# EAGLE board lamloei_unofox_sfm10r4 (EAGLE 7.7.0), part 1 of 2
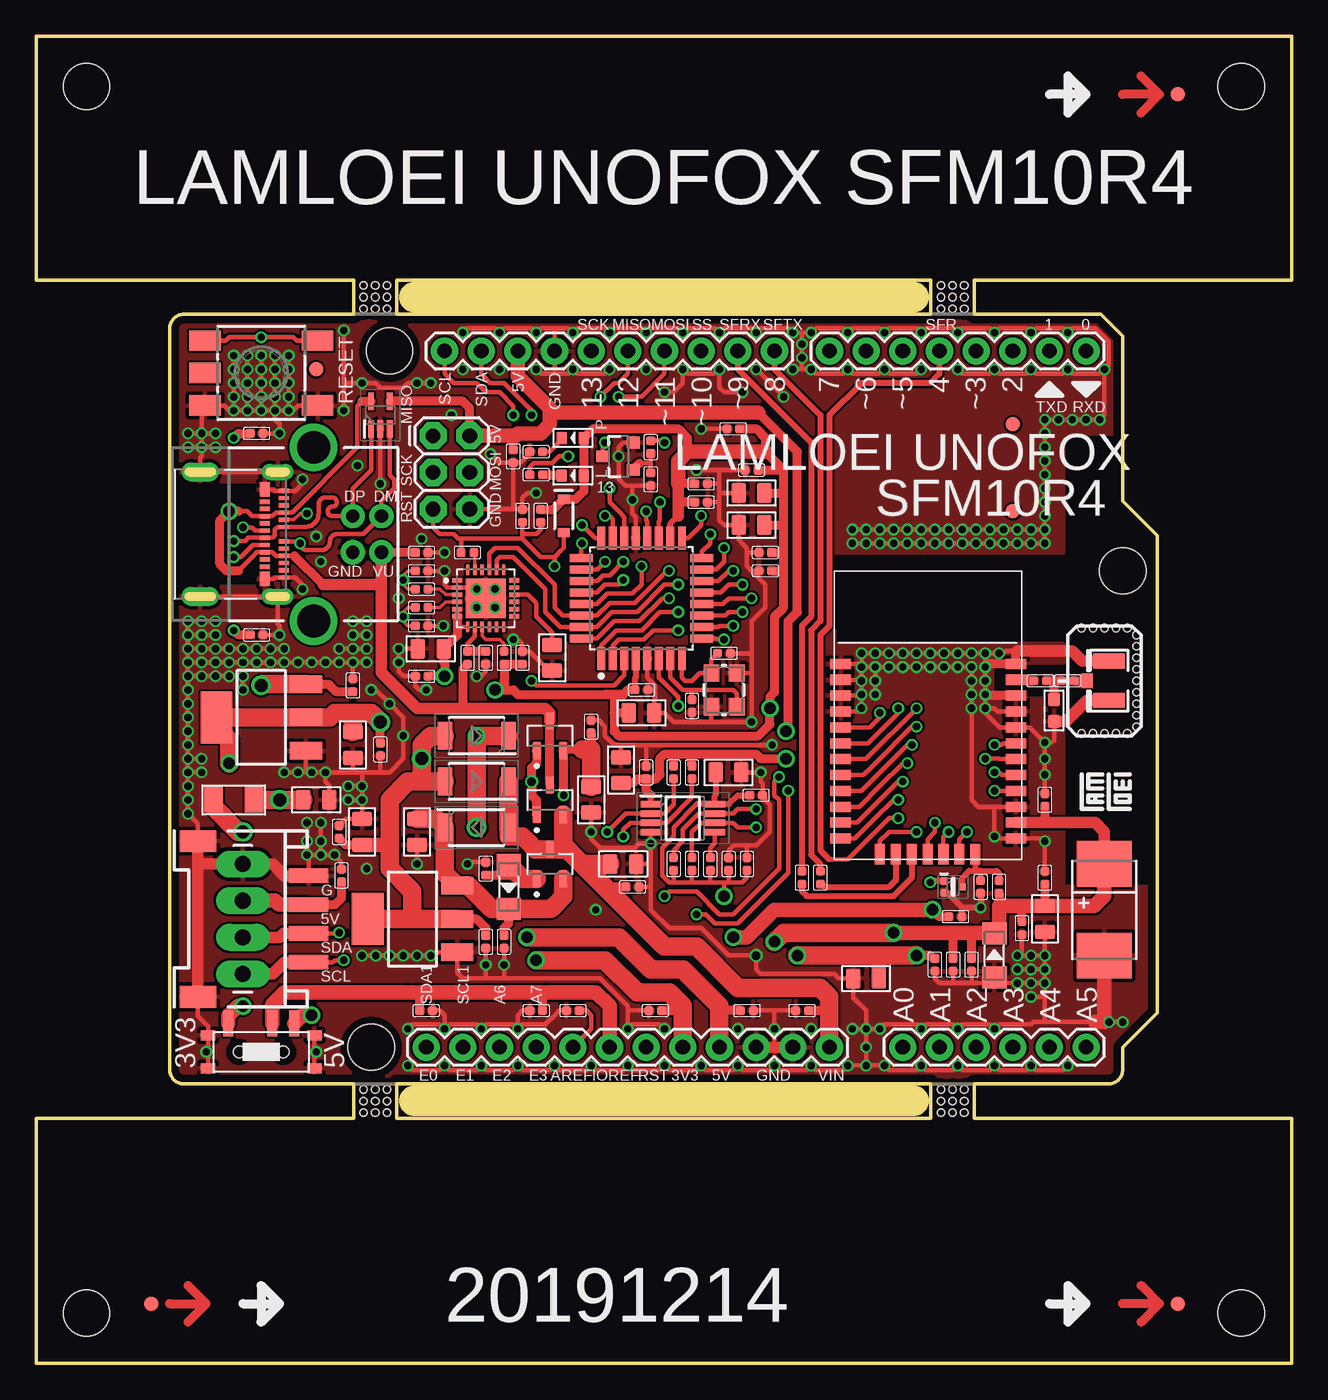
[diagram p2: board, top side]
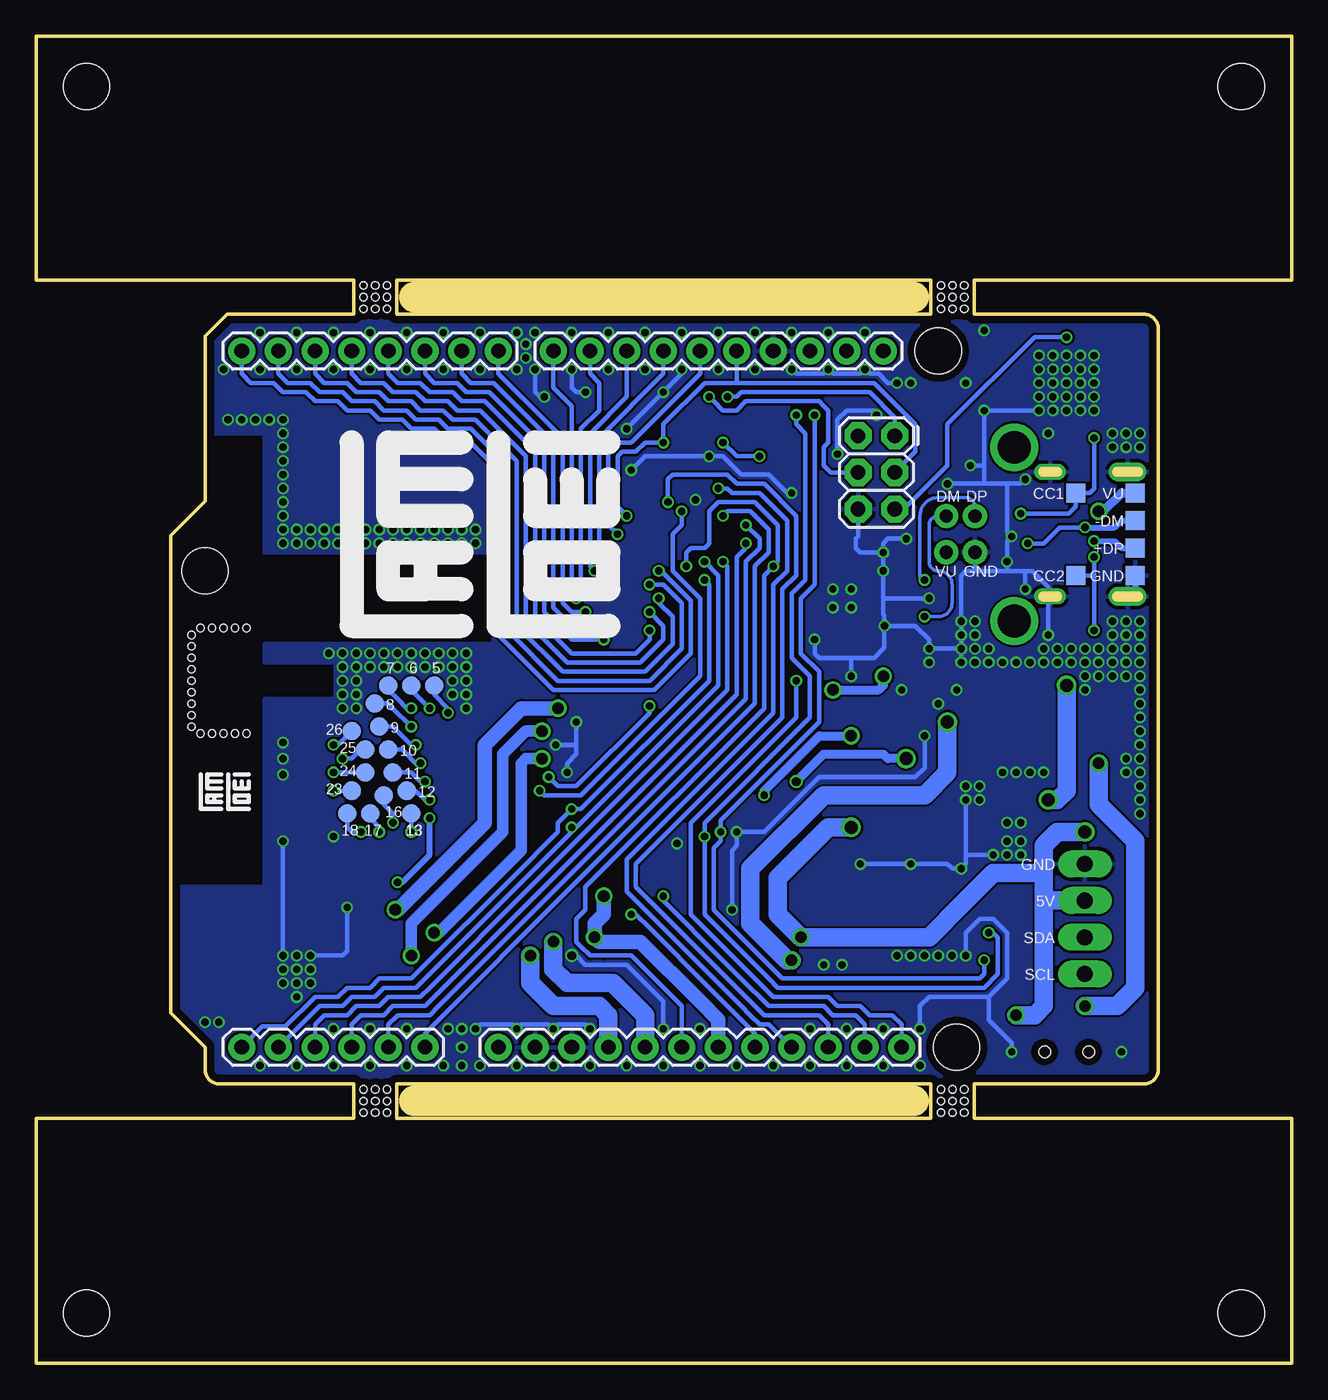
[diagram p3: board, bottom side, seen from below]

Size 87 x 92 mm. Coordinates in mm from the lower left corner, seen from the top.
Outline: 73.77,72.72 75.29,71.19 75.29,59.76 77.67,57.38 77.67,24.3 75.29,21.91 75.29,20.38 arc-90 74.29,19.38 65,19.38 65,17 87,17 87,0 0,0 0,17 22,17 22,19.38 10.25,19.38 arc-90 9.25,20.38
Outline: 9.25,20.39 9.25,71.72 arc-90 10.25,72.72 22,72.72 22,75.09 0,75.09 0,92 87,92 87,75.09 65,75.09 65,72.72 73.75,72.72
Outline: 62,19.38 25,19.38 25,17 62,17 62,19.38
Outline: 62,72.72 62,75.09 25,75.09 25,72.72 62,72.72
Copper layers (1*16): Top 0.035mm / dielectric 1.6mm / Bottom 0.035mm
Design rules "Elecrow_2-layer_PCB_eagle_rule-40": minimum track width 6mil, minimum drill 12mil, track to track 6mil, track to pad 6mil, pad to pad 6mil, via to via 8mil, smd to smd 0mil, copper to edge 20mil, drill to drill 10mil, minimum pad ring 6mil, minimum via ring 6mil, stop-mask expansion 0mil, vias tented up to drill 40mil, thermal gap 10mil
Net classes: 0 default: width 0.254 mm, clearance 0.152 mm; 1 power: width 0.61 mm, drill 0.61 mm, clearance 0.152 mm; 2 gnd: width 0.305 mm, drill 0.483 mm, clearance 0.152 mm; 3 usbvcc: width 0.508 mm, drill 0.61 mm, clearance 0.152 mm; 4 aref: width 0.406 mm, drill 0.61 mm, clearance 0.152 mm
Holes 3.2 mm at 75.29,54.94 24.49,70.17 23.22,21.91 3.5,88.5 3.5,3.5 83.5,88.5 83.5,3.5
Holes 0.5 mm at 23.5,19 22.69,19 24.31,19 63.5,19 64.31,19 62.69,19 22.69,18.19 22.69,17.38 23.5,17.38 23.5,18.19 24.31,18.19 24.31,17.38 63.5,18.19 62.69,18.19 62.69,17.38 63.5,17.38 64.31,17.38 64.31,18.19 63.5,73.09 23.5,73.09 24.31,73.09 22.69,73.09 23.5,73.91 24.31,73.91 22.69,73.91 22.69,74.72 23.5,74.72 24.31,74.72 64.31,73.09 62.69,73.09 63.5,73.91 64.31,73.91 62.69,73.91 62.69,74.72 63.5,74.72 64.31,74.72 72.43,43.66 73.23,43.66 74.02,43.66 74.81,43.66 75.61,43.66 76.24,44.14 76.24,50.49 76.24,44.93 76.24,45.73 76.24,46.52 76.24,47.31 76.24,48.11 76.24,48.9 76.24,49.7 72.43,50.97 73.23,50.97 74.02,50.97 74.81,50.97 75.61,50.97
Milling: 2 lines

## Footprints (pad centres in the part's own frame; a part is rotated, then mirrored left to right if it is on the bottom)
U.FL = smd 2.2 x 1.05: 1 0,1.375; 2 0,-1.375 | smd 0.8 x 1: 3 1.525,0
C0402 = smd 0.635 x 0.635: 1 0,0.445; 2 0,-0.445
C0805 = smd 1.397 x 1.016: 1 0,0.889; 2 0,-0.889
TE-D-7343 = smd 3.175 x 3.81: + 3.175,0; - -3.175,0
SODFL4725X110N = smd 1 x 1.93: 1 -2.2,0; 2 2.2,0
SOD-323 = smd 0.63 x 0.83: A 1.15,0; C -1.15,0
LL-34 = smd 1.524 x 1.676: A -1.524,0; C 1.524,0
F1206 = smd 1.27 x 1.778: 1 -1.397,0; 2 1.397,0
1X08 = drill 1.016 pad 1.88: 1 0,0; 2 2.54,0; 3 5.08,0; 4 7.62,0; 5 10.16,0; 6 12.7,0; 7 15.24,0; 8 17.78,0
1X10 = drill 1.016 pad 1.88: 1 0,0; 2 2.54,0; 3 5.08,0; 4 7.62,0; 5 10.16,0; 6 12.7,0; 7 15.24,0; 8 17.78,0; 9 20.32,0; 10 22.86,0
1X06 = drill 1.016 pad 1.88: 1 0,0; 2 2.54,0; 3 5.08,0; 4 7.62,0; 5 10.16,0; 6 12.7,0
1X12 = drill 1.016 pad 1.88: 1 0,0; 2 2.54,0; 3 5.08,0; 4 7.62,0; 5 10.16,0; 6 12.7,0; 7 15.24,0; 8 17.78,0; 9 20.32,0; 10 22.86,0; 11 25.4,0; 12 27.94,0
2X3 = drill 1.016 pad 1.88 octagon: 1 0,0; 2 0,2.54; 3 2.54,0; 4 2.54,2.54; 5 5.08,0; 6 5.08,2.54
HW4-SMD-2.0-90D = smd 1.01 x 2.74: 1 -3,-0.1; 2 -1,-0.1; 3 1,-0.1; 4 3,-0.1 | smd 1.5 x 2.54: SS1 -5.4,7.559; SS2 5.4,7.559
1X04_LONGPADS = drill 1.118 pad 1.88 long: 1 0,0; 2 2.54,0; 3 5.08,0; 4 7.62,0
SKHM = smd 2.2 x 1.4: 1 -3.9,2.25; 2 3.9,2.25; 3 -3.9,-2.25; 4 3.9,-2.25; 5 3.9,0
SW7-SMD-L6.7X2.7X3.2MM = smd 1.8 x 0.7: A 1.978,2.286; B 1.978,-2.286; COM 1.978,-0.762 | smd 0.7 x 1.016: SS1 -1.15,-3.683; SS2 1.15,-3.683; SS3 1.15,3.683; SS4 -1.15,3.683 | hole 0.813: 0,-1.524; 0,1.524
L0603 = smd 0.889 x 0.889: 1 -0.762,0; 2 0.762,0
LED-0603 = smd 0.762 x 0.889: + -0.762,0; - 0.762,0
SOT23-3 = smd 0.8 x 0.9: 1 -0.95,-1; 2 0.95,-1; 3 0,1.1
SOT91P240X110-3N_DMG2305UX-7 = smd 1.18 x 0.61: 1 -1.025,0.915; 2 -1.025,-0.915; 3 1.025,0
SOTFL40P120X55-3N = smd 0.475 x 0.5: 1 -0.638,0.4; 2 -0.638,-0.4; 3 0.638,0
R0402 = smd 0.635 x 0.635: 1 0,0.445; 2 0,-0.445
TP13SQ = smd 1.3 x 1.3: TP 0,0
B1,27 = smd 1.27 x 1.27: TP 0,0
QFP80P900X900X120-32N = smd 1.6 x 0.55: 1 -4.18,2.8; 2 -4.18,2; 3 -4.18,1.2; 4 -4.18,0.4; 5 -4.18,-0.4; 6 -4.18,-1.2; 7 -4.18,-2; 8 -4.18,-2.8; 17 4.18,-2.8; 18 4.18,-2; 19 4.18,-1.2; 20 4.18,-0.4; 21 4.18,0.4; 22 4.18,1.2; 23 4.18,2; 24 4.18,2.8 | smd 0.55 x 1.6: 9 -2.8,-4.18; 10 -2,-4.18; 11 -1.2,-4.18; 12 -0.4,-4.18; 13 0.4,-4.18; 14 1.2,-4.18; 15 2,-4.18; 16 2.8,-4.18; 25 2.8,4.18; 26 2,4.18; 27 1.2,4.18; 28 0.4,4.18; 29 -0.4,4.18; 30 -1.2,4.18; 31 -2,4.18; 32 -2.8,4.18
CP2104-F03-GMR = smd 0.7 x 0.25: 1 -1.975,1.25; 2 -1.975,0.75; 3 -1.975,0.25; 4 -1.975,-0.25; 5 -1.975,-0.75; 6 -1.975,-1.25; 13 1.975,-1.25; 14 1.975,-0.75; 15 1.975,-0.25; 16 1.975,0.25; 17 1.975,0.75; 18 1.975,1.25 | smd 0.25 x 0.7: 7 -1.25,-1.975; 8 -0.75,-1.975; 9 -0.25,-1.975; 10 0.25,-1.975; 11 0.75,-1.975; 12 1.25,-1.975; 19 1.25,1.975; 20 0.75,1.975; 21 0.25,1.975; 22 -0.25,1.975; 23 -0.75,1.975; 24 -1.25,1.975 | smd 2.75 x 2.75: 25 0,0
SOT223 = smd 1.219 x 2.235: 1 -2.311,-3.099; 2 0,-3.099; 3 2.311,-3.099 | smd 3.6 x 2.2: 4 0,3.099
SOT65P210X110-5N = smd 1.2 x 0.4: 1 -0.95,0.65; 2 -0.95,0; 3 -0.95,-0.65; 4 0.95,-0.65; 5 0.95,0.65
SOP65P490X110-8N = smd 1.425 x 0.45: 1 -2.212,0.975; 2 -2.212,0.325; 3 -2.212,-0.325; 4 -2.212,-0.975; 5 2.212,-0.975; 6 2.212,-0.325; 7 2.212,0.325; 8 2.212,0.975
WSSFM10R = smd 1.4 x 0.7: 1 0.45,13.55; 2 0.45,12.45; 3 0.45,11.35; 4 0.45,10.25; 5 0.45,9.15; 6 0.45,8.05; 7 0.45,6.95; 8 0.45,5.85; 9 0.45,4.75; 10 0.45,3.65; 11 0.45,2.55; 12 0.45,1.45; 20 12.6,1.45; 21 12.6,2.55; 22 12.6,3.65; 23 12.6,4.75; 24 12.6,5.85; 25 12.6,6.95; 26 12.6,8.05; 27 12.6,9.15; 28 12.6,10.25; 29 12.6,11.35; 30 12.6,12.45; 31 12.6,13.55 | smd 0.7 x 1.4: 13 3.18,0.36; 14 4.28,0.36; 15 5.38,0.36; 16 6.48,0.36; 17 7.58,0.36; 18 8.68,0.36; 19 9.78,0.36
105450-0101 = smd 0.3 x 0.7: A1 -3,3.77; A2 -2.5,3.77; A3 -2,3.77; A4 -1.5,3.77; A5 -1,3.77; A6 -0.5,3.77; A7 0.5,3.77; A8 1,3.77; A9 1.5,3.77; A10 2,3.77; A11 2.5,3.77; A12 3,3.77; B2 2.25,2.47; B3 1.75,2.47; B4 1.25,2.47; B5 0.75,2.47; B6 0.25,2.47; B7 -0.25,2.47; B8 -0.75,2.47; B9 -1.25,2.47; B10 -1.75,2.47; B11 -2.25,2.47 | smd 1 x 0.7: B1 3.1,2.47; B12 -3.1,2.47 | drill 0.6 pad 1.1 long: S1 -4.32,3.36; S2 4.32,3.36 | drill 0.6 pad 1.3 long: S3 -4.32,-2; S4 4.32,-2
USB-B-PTH = drill 0.914 pad 1.676: D+ 0,1.25; D- 1.981,1.25; GND 0,-1.25; VBUS 1.981,-1.25 | drill 2.286: S1 -2.718,-6.02; S2 -2.718,6.02
CRYSTAL-SMD-3.2X2.5MM = smd 1.2 x 1.1: 1 -1.175,-0.875; 2 1.175,-0.875; 3 1.175,0.875; 4 -1.175,0.875
FIDUCIAL-1X2 = smd 1 x 1: 1 0,0

## Placement (x,y rotation side)
ANT1  [U.FL]  74.34,47.31 180 top
C1  100nf  [C0402]  26.71,56.2 270 top
C2  NC  [C0402]  26.71,54.94 270 top
C3  NC  [C0402]  26.71,51.12 270 top
C4  4.7uf  [C0805]  27.35,49.54 90 top
C5  100nf  [C0402]  26.71,47.63 90 top
C6  100nf  [C0402]  33.7,48.9 0 top
C7  100nf  [C0402]  29.89,56.2 90 top
C8  4.7uf  [C0805]  35.76,48.9 180 top
C9  100nf  [C0402]  33.06,62.87 180 top
C10  100nf  [C0402]  33.7,58.74 0 top
C11  100nf  [C0402]  48.3,64.78 90 top
C12  100nf  [C0402]  46.08,60.97 270 top
C13  100nf  [C0402]  46.08,59.7 270 top
C14  100nf  [C0402]  49.57,61.92 90 top
C15  4.7uf  [C0805]  49.57,60.33 90 top
C16  4.7uf  [C0805]  49.57,58.11 90 top
C17  100nf  [C0402]  50.52,56.2 90 top
C18  100nf  [C0402]  50.52,54.94 90 top
C19  10pf  [C0402]  47.67,49.22 270 top
C20  10pf  [C0402]  45.45,45.57 180 top
C21  100nf  [C0402]  41.95,46.68 270 top
C22  4.7uf  [C0805]  41.95,45.09 270 top
C23  100nf  [C0402]  21.95,47 0 top
C24  4.7uf  [C0805]  21.95,42.87 180 top
C25  100nf  [C0402]  23.86,42.55 180 top
C26  4.7uf  [C0805]  19.41,39.06 270 top
C27  100nf  [C0402]  21,36.84 0 top
C28  4.7uf  [C0805]  22.59,36.84 0 top
C29  4.7uf  [C0805]  26.39,36.84 180 top
C30  100nf  [C0402]  21.16,33.82 0 top
C31  100nf  [C0402]  38.46,44.14 0 top
C32  4.7uf  [C0805]  38.46,39.06 180 top
C33  100nf  [C0402]  31.16,29.22 180 top
C34  100nf  [C0402]  32.43,29.22 180 top
C35  4.7uf  [C0805]  40.68,34.62 270 top
C36  100nf  [C0402]  41.32,33.03 270 top
C37  4.7uf  [C0805]  40.52,41.12 0 top
C38  100nf  [C0402]  42.27,40.97 0 top
C39  4.7uf  [C0805]  47.98,40.97 270 top
C40  100nf  [C0402]  49.89,39.38 270 top
C41  100nf  [C0402]  47.98,34.62 0 top
C42  100nf  [C0402]  49.26,34.62 0 top
C43  100nf  [C0402]  27.03,24.45 270 top
C44  100nf  [C0402]  34.65,24.45 90 top
C45  100nf  [C0402]  37.19,24.45 90 top
C46  100nf  [C0402]  42.91,24.45 90 top
C47  100nf  [C0402]  49.26,24.45 270 top
C48  100nf  [C0402]  53.06,24.45 90 top
C49  4.7uf  [C0805]  57.51,26.68 90 top
C50  100nf  [C0402]  62.27,27.63 180 top
C51  100nf  [C0402]  63.54,27.63 180 top
C52  100nf  [C0402]  64.81,27.63 180 top
C53  100nf  [C0402]  63.7,30.96 270 top
C54  100nf  [C0402]  65.45,33.03 180 top
C55  100nf  [C0402]  68.31,30.17 180 top
C56  4.7uf  [C0805]  69.89,30.8 180 top
C57  [TE-D-7343]  74.02,31.44 90 top
C58  100nf  [C0402]  69.89,33.66 0 top
C59  100nf  [C0402]  69.89,39.06 0 top
C60  100pf  [C0402]  69.58,47.31 270 top
D1  PMEG4050EP,115  [SODFL4725X110N]  30.52,43.5 180 top
D2  PMEG4050EP,115  [SODFL4725X110N]  30.52,40.33 180 top
D3  PMEG4050EP,115  [SODFL4725X110N]  30.52,37.16 0 top
D4  1N4148  [SOD-323]  36.55,58.74 270 top
D5  [LL-34]  32.75,33.03 270 top
D6  [LL-34]  66.4,28.27 90 top
F1  SMD1206R500SF  [F1206]  13.7,39.06 0 top
J1  [1X08]  72.75,70.17 180 top
J2  [1X10]  51.16,70.17 180 top
J3  [1X06]  72.75,21.91 180 top
J4  [1X12]  54.97,21.91 180 top
J5  FEMALE 2x3  [2X3]  27.51,64.3 270 top
J6  4P-SMD-2.0-90D  [HW4-SMD-2.0-90D]  18.77,30.8 90 top
J7  [1X04_LONGPADS]  14.33,34.62 270 top
K1  SKHM  [SKHM]  15.6,68.65 180 top
K2  MK-12C02  [SW7-SMD-L6.7X2.7X3.2MM]  15.6,21.6 90 top
L1  47nH  [L0603]  70.53,45.25 90 top
LED1  BLUE-0603  [LED-0603]  37.19,64.14 180 top
LED2  YELLOW-0603  [LED-0603]  37.19,61.54 180 top
Q1  220mA/50V/3.5Ω  [SOT23-3]  40.36,62.87 90 top
Q2  DMG2305UX-7  [SOT91P240X110-3N_DMG2305UX-7]  35.6,43.5 90 top
Q3  DMG2305UX-7  [SOT91P240X110-3N_DMG2305UX-7]  35.6,39.06 90 top
Q4  DMG2305UX-7  [SOT91P240X110-3N_DMG2305UX-7]  35.6,34.62 90 top
Q5  DTC044TMT2L  [SOTFL40P120X55-3N]  63.54,33.03 0 top
R1  5.1K  [R0402]  15.28,64.46 270 top
R2  5.1K  [R0402]  15.28,50.49 270 top
R3  0R  [R0402]  26.71,53.66 90 top
R4  0R  [R0402]  26.71,52.4 90 top
R5  24K  [R0402]  29.89,48.9 0 top
R6  47K  [R0402]  31.16,48.9 0 top
R7  12K  [R0402]  32.43,48.9 180 top
R8  2.2K  [R0402]  34.65,63.19 90 top
R9  2.2K  [R0402]  34.65,61.6 90 top
R10  2.2K  [R0402]  42.59,63.51 180 top
R11  100K  [R0402]  42.59,61.28 180 top
R12  12K  [R0402]  34.97,58.74 180 top
R13  100K  [R0402]  31.16,34.3 0 top
R14  100K  [R0402]  44.17,40.97 180 top
R15  100K  [R0402]  45.45,40.97 180 top
R16  100K  [R0402]  44.17,34.62 0 top
R17  100K  [R0402]  45.45,34.62 0 top
R18  100K  [R0402]  46.72,34.62 180 top
R19  0  [R0402]  53.06,33.66 180 top
R20  0  [R0402]  54.34,33.66 180 top
R21  12K  [R0402]  66.72,33.03 0 top
R22  0  [R0402]  71.48,47.31 270 top
TP1  TPSQTP13SQ  [TP13SQ]  10.84,60.33 0 bottom
TP2  TPSQTP13SQ  [TP13SQ]  10.84,58.43 0 bottom
TP3  TPSQTP13SQ  [TP13SQ]  10.84,56.52 0 bottom
TP4  TPSQTP13SQ  [TP13SQ]  10.84,54.62 0 bottom
TP5  TPSQTP13SQ  [TP13SQ]  14.96,60.33 0 bottom
TP6  TPSQTP13SQ  [TP13SQ]  14.96,54.62 0 bottom
TP7  PTR1B1,27  [B1,27]  59.41,47 0 bottom
TP8  PTR1B1,27  [B1,27]  61,47 0 bottom
TP9  PTR1B1,27  [B1,27]  62.59,47 0 bottom
TP10  PTR1B1,27  [B1,27]  63.54,45.73 0 bottom
TP11  PTR1B1,27  [B1,27]  63.23,44.14 0 bottom
TP12  PTR1B1,27  [B1,27]  62.59,42.55 0 bottom
TP13  PTR1B1,27  [B1,27]  62.27,40.97 0 bottom
TP14  PTR1B1,27  [B1,27]  61.32,39.7 0 bottom
TP15  PTR1B1,27  [B1,27]  61,38.11 0 bottom
TP16  PTR1B1,27  [B1,27]  62.91,39.38 0 bottom
TP17  PTR1B1,27  [B1,27]  63.86,38.11 0 bottom
TP18  PTR1B1,27  [B1,27]  65.45,38.11 0 bottom
TP19  PTR1B1,27  [B1,27]  65.13,39.7 0 bottom
TP20  PTR1B1,27  [B1,27]  64.18,40.97 0 bottom
TP21  PTR1B1,27  [B1,27]  64.18,42.55 0 bottom
TP22  PTR1B1,27  [B1,27]  65.13,43.82 0 bottom
U1  ATMEGA328PB-AU  [QFP80P900X900X120-32N]  41.95,53.03 90 top
U2  CP2104-F03-GMR  [CP2104-F03-GMR]  31.16,53.03 0 top
U3  [SOT223]  15.6,44.77 90 top
U4  [SOT223]  26.08,30.8 90 top
U5  ESDA6V1W5  [SOT65P210X110-5N]  23.86,65.73 90 top
U6  PCA9517ADP,118  [SOP65P490X110-8N]  44.81,37.79 0 top
U7  WSSFM10RWSSFM10R2R4  [WSSFM10R]  55.29,34.93 0 top
USB1  105450-0101  [105450-0101]  13.38,57.48 270 top
USB2  USB-B  [USB-B-PTH]  21.95,57.48 0 top
X1  16MHZ  [CRYSTAL-SMD-3.2X2.5MM]  47.67,46.68 90 top
ZFC1  FIDUCIAL1X2  [FIDUCIAL-1X2]  19.41,68.91 0 top
ZFC2  FIDUCIAL1X2  [FIDUCIAL-1X2]  67.67,65.09 0 top
ZFC3  FIDUCIAL1X2  [FIDUCIAL-1X2]  67.67,59.06 0 top
ZFD1  FIDUCIAL1X2  [FIDUCIAL-1X2]  79.1,87.95 0 top
ZFD2  FIDUCIAL1X2  [FIDUCIAL-1X2]  7.98,4.13 0 top
ZFD3  FIDUCIAL1X2  [FIDUCIAL-1X2]  79.1,4.13 0 top
ZL1  LAMLEOI_LOGO_3  [LAMLEOI_LOGO_3]  72.12,38.11 0 top
ZL2  LAMLEOI_LOGO_3  [LAMLEOI_LOGO_3]  75.92,38.11 0 bottom
ZL3  LAMLOEI_BIGLOGO  [LAMLOEI_BIGLOGO]  65.13,51.12 0 bottom